# Altium schematic sheet Serial Power Supply - Main.SchDoc
size Legal
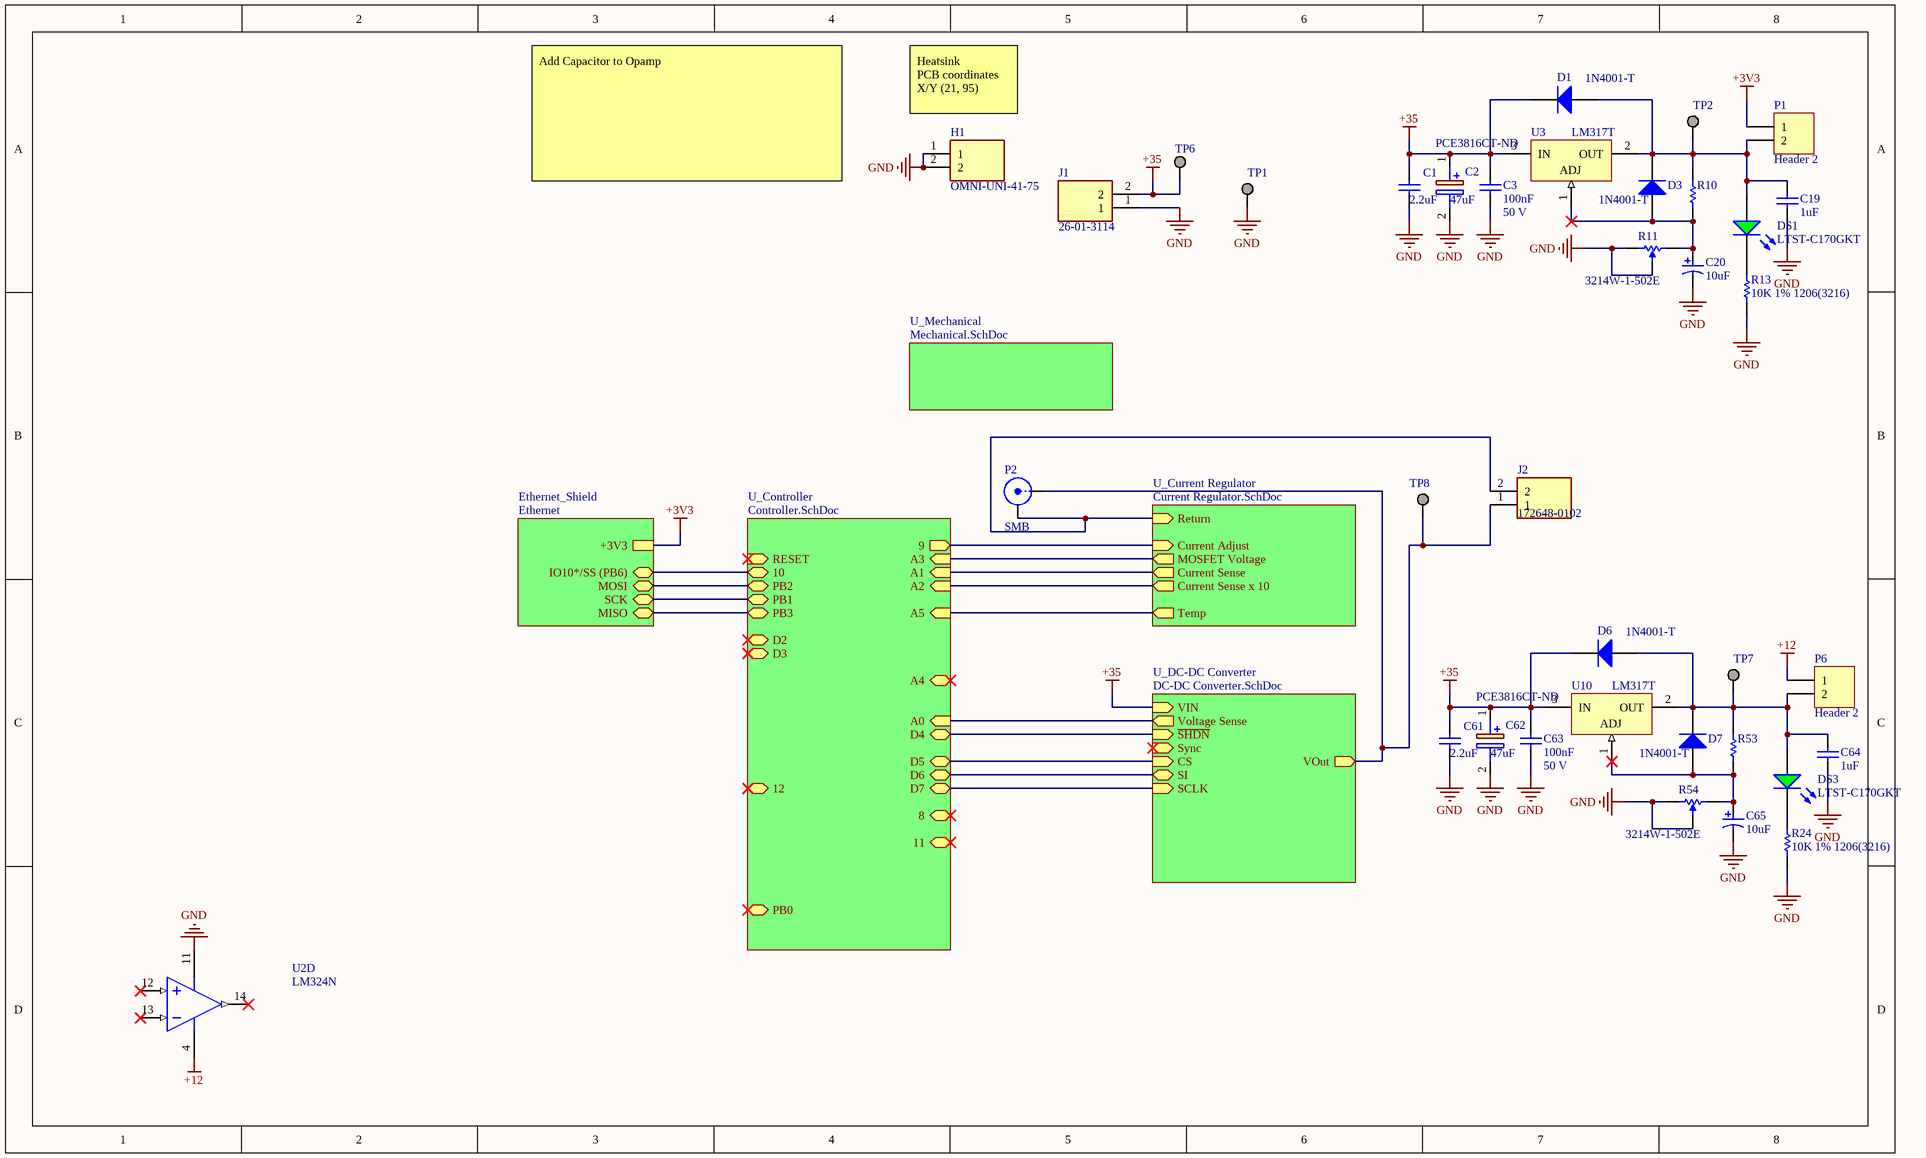
[diagram p0: Serial Power Supply - Main.SchDoc]

## Parts
C1  value 2.2uF  [CAPC1812(4532)280_L]  (hidden comment: CAP 2.2uF 100V 1812(4532))
C2  47uF  Supplier Part Number 1: PCE3816CT-ND  [CAPAE660X800N]
C3  value 100nF  Rated Voltage: 50 V  [CAPC1206(3216)100_L]  (hidden comment: CAP 100nF 50V 1206(3216))
C19  1uF  [CAPC3216X180X55LL15T30]
C20  10uF  [PNSC-FK-V-D_V]
C61  value 2.2uF  [CAPC1812(4532)280_L]  (hidden comment: CAP 2.2uF 100V 1812(4532))
C62  47uF  Supplier Part Number 1: PCE3816CT-ND  [CAPAE660X800N]
C63  value 100nF  Rated Voltage: 50 V  [CAPC1206(3216)100_L]  (hidden comment: CAP 100nF 50V 1206(3216))
C64  1uF  [CAPC3216X180X55LL15T30]
C65  10uF  [PNSC-FK-V-D_V]
D1  1N4001-T  [DIOD-DO-41-P-2_V]
D3  1N4001-T  [DIOD-DO-41-P-2_V]
D6  1N4001-T  [DIOD-DO-41-P-2_V]
D7  1N4001-T  [DIOD-DO-41-P-2_V]
DS1  LTST-C170GKT  [LTST-C170GKT_V]
DS3  LTST-C170GKT  [LTST-C170GKT_V]
H1  OMNI-UNI-41-75  [OMNIUNI4175]
J1  26-01-3114  [0026013114]
J2  172648-0102  [1726480102]
P1  Header 2  [HDR1X2]
P2  SMB  [SMB_V-RJ45]
P6  Header 2  [HDR1X2]
R10  ERA8AEB471V  [RESC3216X70X50LL20T25]  (value not drawn)
R11  3214W-1-502E  [BOUR-3214W_V]
R13  10K 1% 1206(3216)  [RESC1206(3216)_L]
R24  10K 1% 1206(3216)  [RESC1206(3216)_L]
R53  ERA8AEB471V  [RESC3216X70X50LL20T25]  (value not drawn)
R54  3214W-1-502E  [BOUR-3214W_V]
TP1  GND  [KSTN-1502-2]  (value not drawn)
TP2  3V3  [KSTN-1502-2]  (value not drawn)
TP6  +20V  [KSTN-1502-2]  (value not drawn)
TP7  12V  [KSTN-1502-2]  (value not drawn)
TP8  +20V  [KSTN-1502-2]  (value not drawn)
U2  LM324N  [N14A]  (part D of 4)
U3  LM317T  [TO-220]
U10  LM317T  [TO-220]

## Sub-sheets
Ethernet_Shield = Ethernet: +3V3, IO10*/SS (PB6) (bidir), MOSI (bidir), SCK (bidir), MISO (bidir)
U_Controller = Controller.SchDoc: PB3 (bidir), PB2 (bidir), PB1 (bidir), PB0 (bidir), RESET (in), D2 (bidir), A0 (in), 9 (out), D4 (bidir), A5 (in), 10 (bidir), A1 (in), D6 (bidir), A3 (in), A2 (in), 11 (bidir), 8 (bidir), 12 (bidir), D3 (bidir), A4 (bidir), D7 (bidir), D5 (bidir)
U_Current Regulator = Current Regulator.SchDoc: Return (in), Current Adjust (in), Current Sense x 10 (out), Current Sense (out), MOSFET Voltage (out), Temp (out)
U_DC-DC Converter = DC-DC Converter.SchDoc: Sync (in), VIN (in), ~{SHDN} (in), VOut (out), CS (in), Voltage Sense (out), SCLK (in), SI (bidir)
U_Mechanical = Mechanical.SchDoc: no entries

## Nets
+3V3: P1.1 ; sheet Ethernet_Shield/+3V3
+12: P6.1 U2.4(V+)
+35: C1.2 C2.1(+) C3.1 C61.2 C62.1(+) C63.1 D1.2(K) D6.2(K) J1.2 TP6.1 U3.3(IN) U10.3(IN) ; sheet U_DC-DC Converter/VIN
GND: C1.1 C2.2(-) C3.2 C19.1 C20.2 C61.1 C62.2(-) C63.2 C64.1 C65.2 H1.1 H1.2 J1.1 R11.1 R11.2 R13.1 R24.1 R54.1 R54.2 TP1.1 U2.11(GND)
NetC19_2: C19.2 D1.1(A) D3.2(K) DS1.1(A) P1.2 R10.2 TP2.1 U3.2(OUT)
NetC20_1: C20.1 D3.1(A) R10.1 R11.3 U3.1(ADJ)
NetC64_2: C64.2 D6.1(A) D7.2(K) DS3.1(A) P6.2 R53.2 TP7.1 U10.2(OUT)
NetC65_1: C65.1 D7.1(A) R53.1 R54.3 U10.1(ADJ)
NetDS1_2: DS1.2(K) R13.2
NetDS3_2: DS3.2(K) R24.2
NetJ2_1: J2.1 P2.1(X) TP8.1 ; sheet U_DC-DC Converter/VOut
NetJ2_2: J2.2 P2.2(Y) ; sheet U_Current Regulator/Return
(unnamed): sheet U_DC-DC Converter/~{SHDN}, sheet U_Controller/D4
(unnamed): sheet U_DC-DC Converter/CS, sheet U_Controller/D5
(unnamed): sheet U_DC-DC Converter/Voltage Sense, sheet U_Controller/A0
(unnamed): sheet U_DC-DC Converter/SCLK, sheet U_Controller/D7
(unnamed): sheet U_DC-DC Converter/SI, sheet U_Controller/D6
(unnamed): sheet U_Controller/PB3, sheet Ethernet_Shield/MISO
(unnamed): sheet U_Controller/PB2, sheet Ethernet_Shield/MOSI
(unnamed): sheet U_Controller/PB1, sheet Ethernet_Shield/SCK
(unnamed): sheet U_Controller/9, sheet U_Current Regulator/Current Adjust
(unnamed): sheet U_Controller/A5, sheet U_Current Regulator/Temp
(unnamed): sheet U_Controller/10, sheet Ethernet_Shield/IO10*/SS (PB6)
(unnamed): sheet U_Controller/A1, sheet U_Current Regulator/Current Sense
(unnamed): sheet U_Controller/A3, sheet U_Current Regulator/MOSFET Voltage
(unnamed): sheet U_Controller/A2, sheet U_Current Regulator/Current Sense x 10

Not connected (* = marked no-connect by the designer): U2 12(IN4+)* 13(IN4-)* 14(OUT4)*

## Notes on the sheet
- (near H1) Heatsink
  PCB coordinates X/Y (21, 95)
- Add Capacitor to Opamp
- Title
- Size:
- Date:
- Legal
- Number:
- Time:
- Revision:
- Sheet
- of
- File:

## Library data of the parts
C1 C61 = CMP-1040-01635-1: CAP 2.2uF 100V ±10% 1812 (4532 Metric) Thickness 2.8mm SMD; Case-Metric: 4532; Case-EIA: 1812; Tolerance: Â±10%; Rated Voltage: 100 V; Max Thickness: 2.8 mm; Technology: SMT; Supplier 1: Digi-Key; Supplier Part Number 1: 445-4510-2-ND
C2 C62 = EEE-FK1H470XP: Capacitor Polarised / 47uF 50V / EEE-FK1H470XP; Manufacturer_Name: Panasonic; Allied_Number: 70258115; Datasheet Link: https://industrial.panasonic.com/cdbs/www-data/pdf/RDE0000/ABA0000C1181.pdf; Height: 8mm; Manufacturer_Part_Number: EEE-FK1H470XP; Mouser Part Number: 667-EEE-FK1H470XP; Mouser Price/Stock: https://www.mouser.co.uk/ProductDetail/Panasonic/EEE-FK1H470XP?qs=qE6bgDGEOCtuVppQsylaxg%3D%3D; Allied Price/Stock: https://www.alliedelec.com/panasonic-eee-fk1h470xp/70258115/; Supplier 1: Digi-Key
C3 C63 = CMP-1037-04202-1: CAP 100nF 50V ±10% 1206 (3216 Metric) Thickness 1mm SMD; Case-Metric: 3216; Tolerance: Â±10%; Case-EIA: 1206; Technology: SMT; Max Thickness: 1 mm
C19 C64 = CMP-2000-06418-1: Chip Capacitor, 1 uF, +/- 10%, 100 V, -55 to 125 degC, 1206 (3216 Metric), RoHS, Tape and Reel / HMK316B7105KL-T; PCN Part Number: X5R,X7RDielectrics23/Jan/2008; Manufacturer: Taiyo Yuden; Other Names: 587-1777-1; Online Catalog: MSeries; Kits: 587-1794-KIT-ND-KITCAPCERAMICHICAPMLCCSMD; Temperature Coefficient: X7R; Voltage - Rated: 100V; Catalog Drawings: xMKSeries_1206_1.6; Capacitance: 1µF; Standard Package: 1; Manufacturer URL: http://www.t-yuden.com/; Mounting Technology: SurfaceMount; Height - Seated (Max): -; Lead Style: -; Mounting Type: SurfaceMount,MLCC; Thickness (Max): 0.071"(1.80mm); Applications: GeneralPurpose; Lead Spacing: -; Operating Temperature: -55°C~125°C; Size / Dimension: 0.126"Lx0.063"W(3.20mmx1.60mm); Features: HighVoltage; Ratings: -; Category: Capacitors; Datasheet Version: 09/2015; Package Description: 2-Pin Surface Mount Device, Body 3.2 x1.6 mm; Tolerance: ±10%; Family: CeramicCapacitors; Package Reference: 1206; Packaging: CutTape(CT); Datasheet URL: http://www.yuden.co.jp/productdata/catalog/en/mlcc_all_e.pdf; Package / Case: 1206(3216Metric); Series: M
C20 C65 = CMP-2000-06207-1: Aluminum Electrolytic Capacitor, 10 uF, +/- 20%, 50 V, 2-Pin SMD (Size Code D), -55 to 105 degC, RoHS, Tape and Reel / EEEFK1H100P; Manufacturer: Panasonic; Lifetime@Temperature: 2000Hrs@105°C; Type: Can; Rated Voltage: 50V; Ripple Current: 165mA; Impedance: 0.88O; Capacitance: 10µF; Manufacturer URL: http://www.panasonic.com/; Mounting Technology: SurfaceMount; Datasheet URL: http://industrial.panasonic.com/cdbs/www-data/pdf/RDE0000/ABA0000C1181.pdf; Package Reference: FK-V-D; Series: FK; Operating Temp Range: -55to+105°C; Operating Temp-Max: 105°C; Datasheet Version: 03/2016; Package URL: http://industrial.panasonic.com/cdbs/www-data/pdf/RDE0000/DME0000COL48.pdf; Case Size/Dimension: Ø6.3x5.8mm; Package Description: 2-Pin Electrolytic Aluminum Capacitor, Body 6.6 x 6.6 mm
D1 D3 D6 D7 = CMP-0639-00006-2: 1.0 A Rectifier, 15 pF, 50 V, -65 to 150 degC, 2-Pin DO-41 Plastic, RoHS, Tape and Reel; Manufacturer: Diodes Inc; VF (V): 1; CT (pF): 15; Max. IR (uA): 5; VRRM (V): 50; Max. IFSM (A): 30; RoHS: TRUE; Mounting Technology: Through Hole; PartNumber: 1N4001-T; ComponentLink2Description: Datasheet; DatasheetVersion: Rev. 8-2; Operating Temperature Range (degC): -65 to 150; Packing: Tape and Reel; PackageReference: DO-41-P-2; ComponentLink1URL: http://diodes.com/; PackageDescription: 2-Pin Axial Lead, Body 4.635 x 2.36 mm, Lead Spread 25.4 mm; ComponentLink2URL: http://diodes.com/datasheets/ds28002.pdf; Max. Average Rectified Current IO (A): 1; ComponentLink1Description: Manufacturer URL
DS1 DS3 = CMP-1674-00002-5: LED Uni-Color Green, 100 mW, 120 mA, -55 to 85 degC, 2-Pin SMD, RoHS, Tape and Reel; Manufacturer: Lite-On; ComponentLink1URL: http://www.us.liteon.com/; Height: 1.1 mm; PackageDescription: 2-Pin Surface Mount Device, Body 2 x 1.25 mm; RoHSCompliant: true; Package Quantity: 1; Packaging: Tape and Reel; Mount: Surface Mount; Min Operating Temperature: -55 degC; DatasheetVersion: 03/2003; Max Operating Temperature: 85 degC; ComponentLink1Description: Manufacturer URL; Pins: 2; Mounting Technology: Surface Mount; Length: 2 mm; Colour: Green; PackageReference: C170GKT; ComponentLink2URL: http://media.digikey.com/pdf/Data%20Sheets/Lite-On%20PDFs/LTST-C170GKT.pdf; ComponentLink2Description: Datasheet
H1 = OMNI-UNI-41-75: Hardware; Manufacturer_Name: Wakefield-Vette; Datasheet Link: https://componentsearchengine.com/Datasheets/1/OMNI-UNI-41-75.pdf; Height: 63mm; Manufacturer_Part_Number: OMNI-UNI-41-75; Mouser Part Number: 567-OMNI-UNI-41-75; Mouser Price/Stock: https://www.mouser.co.uk/ProductDetail/Wakefield-Vette/OMNI-UNI-41-75?qs=u4fy%2FsgLU9MMQhJzv7kr6g%3D%3D
J1 = 26-01-3114: Connector; Manufacturer_Name: Molex; Datasheet Link: http://www.molex.com/webdocs/datasheets/pdf/en-us//0026013114_PCB_HEADERS.pdf; Height: 9mm; Manufacturer_Part_Number: 26-01-3114; Arrow Part Number: 26-01-3114; Mouser Part Number: 538-26-01-3114; Mouser Price/Stock: https://www.mouser.co.uk/ProductDetail/Molex/26-01-3114?qs=ZhwKFWhxrSEC8%252Bv2mQsO9A%3D%3D
J2 = 172648-0102: Connector; Manufacturer_Name: Molex; Datasheet Link: https://www.molex.com/pdm_docs/sd/1726480102_sd.pdf; Height: 5.4mm; Manufacturer_Part_Number: 172648-0102; Arrow Part Number: 172648-0102; Mouser Part Number: 538-172648-0102; Mouser Price/Stock: https://www.mouser.co.uk/ProductDetail/Molex/172648-0102?qs=OAhjpuo3Vu6rwl2O%2FXoypw%3D%3D
P1 P6 = Header 2: Header, 2-Pin; LatestRevisionDate: 17-Jul-2002; LatestRevisionNote: Re-released for DXP Platform.; Publisher: Altium Limited
P2 = SMB: SMB Straight Connector; LatestRevisionDate: 17-Jul-2002; LatestRevisionNote: Re-released for DXP Platform.; Publisher: Altium Limited
R10 R53 = CMP-2003-04470-1: 470 ohm; Manufacturer: Panasonic; Part Number: ERA8AEB471V
R11 R54 = CMP-2000-05579-1: 3214 - 5-Turn Trimpot(R) Trimming Potentiometer, 5 KOhm, +/- 10%, 0.25 W, -65 to 150 degC, RoHS, Tape and Reel; Manufacturer: Bourns; Temperature Coefficient: ±100ppm/°C; Power Rating: 250mW; No. of Turns: 5; Track Resistance: 5kohm; SVHC: NoSVHC(16-Jun-2014); Potentiometer Mounting: SMD; Manufacturer URL: http://www.bourns.com/; Resistance Tolerance: ±10%; Datasheet URL: http://www.bourns.com/docs/Product-Datasheets/3214.pdf; ROHS COMPLIANT: Yes; Mounting Technology: SurfaceMount; Datasheet Version: 05/2016; Package Reference: 3214W; Package Description: 3-Pin Surface Mount Device, Body 3.5 x 4.8 mm, Pitch 1.25 mm
R13 R24 = CMP-1014-00623-1: 10K 0.25W 1% 1206 (3216 Metric)  SMD; Case-Metric: 3216; Value: 10000.00 Ohm; Case-EIA: 1206; Power: 0.25 W; Technology: SMT; Tolerance: 1 %
TP1 TP2 TP6-TP8 = CMP-1672-00001-4: Terminal DBL Turret, Through Hole, RoHS; Contact Finish: Tin; Lead Pitch: 0.218 inch; PackageReference: 1502-2; Mount: Through Hole; Pins: 50; DatasheetVersion: Rev. A, 02/2008; RoHSCompliant: true; REACH SVHC: No SVHC; Contact Material: Brass; Length: 2.77 mm; PackageDescription: 1-Pin Through Hole Device, Dia 3.18 mm; Package Quantity: 1; Mounting Technology: Through Hole; Supplier 1: Mouser; Supplier Part Number 1: 575-2501200800000
U2 = CMP-0055-00082-1: Low Power Quad Operational Amplifier, 14-pin MDIP; Manufacturer: National Semiconductor; PackageTopMarking: NSUZXYYTTE#*LM324N; PowerWise: N; CompType: Amplifiers; PinCount: 14; PackageVersion: revG, May-2006; PackageReference: N14A; Code_JEDEC: MS-001-AA; PackageDescription: MDIP, .750 x .250 x.130in, 14 Lead, .100in Pitch; RoHS: N; DatasheetVersion: Aug-2000
U3 U10 = CMP-0244-00444-1: 1.5A, 1.2V to 37V Adjustable Voltage Regulator, 3-Pin TO-220; PackageVersion: 2011; ComponentLink1URL: http://www.st.com; ComponentLink2URL: http://www.st.com/internet/com/TECHNICAL_RESOURCES/TECHNICAL_LITERATURE/DATASHEET/CD00000455.pdf; PackageDescription: TO, Thru-Hole, Vertical, Heatsink Mounted; 3 In-Line Leads; Pitch 2.54 mm; PackageReference: TO-220; ComponentLink1Description: Manufacturer URL; ComponentLink3URL: http://www.st.com/internet/com/TECHNICAL_RESOURCES/TECHNICAL_LITERATURE/PACKAGE_INFORMATION/CD00004649.pdf; DatasheetVersion: 1/11/2011; ComponentLink2Description: Datasheet; ComponentLink3Description: Package Specification